# Altium schematic sheet OCXO.SchDoc: Oven Controlled Crystal Oscillator
size A4; Date: 27.09.2023; ApprovedBy: M.Sc. Tobias Wirth; CheckedBy: M.Sc. Tobias Wirth; Author: M.Sc. Tobias Wirth; CompanyName: University of Stuttgart; DrawnBy: M.Sc. Tobias Wirth; Engineer: M.Sc. Tobias Wirth; Organization: IIS; Address1: Pfaffenwaldring 47; Address2: 70569 Stuttgart; Revision: V1.1; SheetNumber: 4; SheetTotal: 17; ProjectNameAlt: AUS - NMR System; Time: 14:20; ImagePath: N/A; Application_BuildNumber: N/A
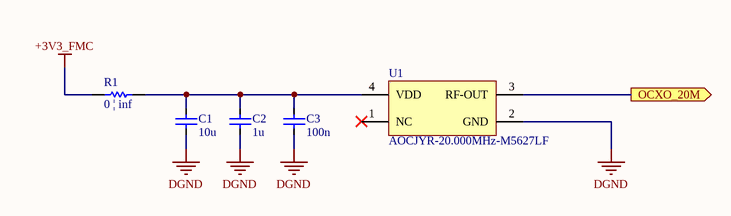
[diagram p0: OCXO.SchDoc]

## Parts
C1  10u  [CAP_0603]
C2  1u  [CAP_0402]
C3  100n  [CAP_0402]
R1  0 | inf  [RES_0402]
U1  AOCJYR-20.000MHz-M5627LF  [AOCJYR20000MHZM5627LFT]

## Ports
OCXO_20M (out)

## Nets
+3V3_FMC: R1.2
DGND: C1.2 C2.2 C3.2 U1.2(GND)
OCXO_20M: U1.3(RF-OUT) ; port OCXO_20M
NetC1_1: C1.1 C2.1 C3.1 R1.1 U1.4(VDD)

Not connected (* = marked no-connect by the designer): U1 1(NC)*

## Notes on the sheet
- Title
- Size
- Date:
- Sheet
- A4
- of
- Project
- Drawn By:
- Revision:

## Library data of the parts
C1-C3 = Cap: Supplier: *; Part Number: *
  C1: Value: 10u
  C2: Value: 1u
  C3: Value: 100n
R1 = Res: Part Number: *; Supplier: *; Value: 0 | inf
U1 = AOCJYR-20.000MHz-M5627LF: Supplier 1: Mouser; Supplier Part Number 1: 815-AOCJYR-20M5627